# EAGLE design LED ONLY v1 (EAGLE 6.5.0)
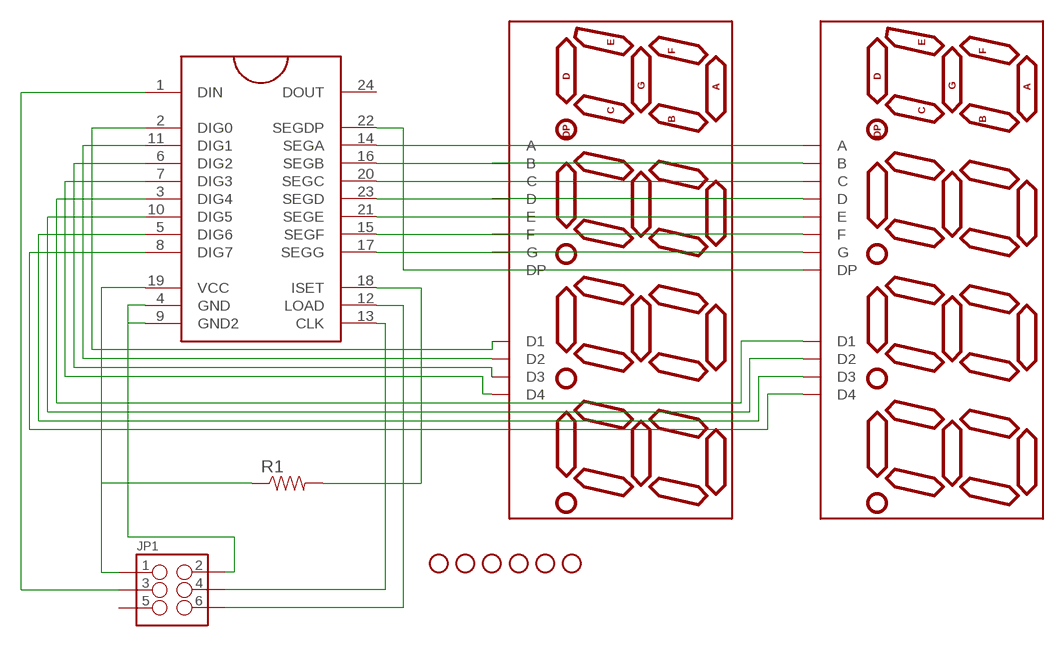
[diagram p0: schematic, sheet 1]

## Parts
JP1  M03X2  [2X3-SHROUDED]
R1  RESISTORPTH-1/4W  [AXIAL-0.4]
STANDOFF1  STAND-OFF  [STAND-OFF]
STANDOFF2  STAND-OFF  [STAND-OFF]
STANDOFF3  STAND-OFF  [STAND-OFF]
STANDOFF4  STAND-OFF  [STAND-OFF]
STANDOFF5  STAND-OFF  [STAND-OFF]
STANDOFF6  STAND-OFF  [STAND-OFF]
U$3  MAX7219DIP  [DIL24]
U$4  7-SEGMENT-4DIGIT-COUNTERPTH  [7-SEGMENT-4DIGIT-COUNTER]
U$5  7-SEGMENT-4DIGIT-COUNTERPTH  [7-SEGMENT-4DIGIT-COUNTER]

## Nets
N$1: U$3.14(SEGA) U$4.11(A) U$5.11(A)
N$2: U$3.16(SEGB) U$4.7(B) U$5.7(B)
N$3: U$3.20(SEGC) U$4.4(C) U$5.4(C)
N$4: U$3.23(SEGD) U$4.2(D) U$5.2(D)
N$5: U$3.21(SEGE) U$4.1(E) U$5.1(E)
N$6: U$3.15(SEGF) U$4.10(F) U$5.10(F)
N$7: U$3.17(SEGG) U$4.5(G) U$5.5(G)
N$8: U$3.22(SEGDP) U$4.3(DP) U$5.3(DP)
N$9: U$3.2(DIG0) U$4.12(D1)
N$10: U$3.11(DIG1) U$4.9(D2)
N$11: U$3.6(DIG2) U$4.8(D3)
N$12: U$3.7(DIG3) U$4.6(D4)
N$13: JP1.1 R1.P$1 U$3.19(VCC)
N$14: JP1.2 U$3.4(GND) U$3.9(GND2)
N$15: U$3.3(DIG4) U$5.12(D1)
N$16: U$3.10(DIG5) U$5.9(D2)
N$17: U$3.5(DIG6) U$5.8(D3)
N$18: U$3.8(DIG7) U$5.6(D4)
N$19: R1.P$2 U$3.18(ISET)
N$21: JP1.3 U$3.1(DIN)
N$22: JP1.6 U$3.12(LOAD)
N$23: JP1.4 U$3.13(CLK)
Unconnected: JP1.5 U$3.24(DOUT)

## Library data of the parts
JP1 = SparkFun-Connectors:M03X2: 2x3 .1" header. Shrouded, with keying- CONN-10681 SMT- CONN-11415 Pogo pins- HW-11044; PROD_ID: CONN-10681
R1 = SparkFun-Resistors:RESISTOR: Resistor Basic schematic elements and footprints for 0603, 1206, and PTH resistors.
STANDOFF1-STANDOFF6 = SparkFun-Electromechanical:STAND-OFF: #4 Stand Off This is the mechanical footprint for a #4 phillips button head screw. Use the keepout ring to avoid running the screw head into surrounding components. SKU : PRT-00447
U$3 = SparkFun-DigitalIC:MAX7219: 8-digit, 8-segment LED display driver, serial input
U$4 U$5 = SparkFun-Displays:7-SEGMENT-4DIGIT-COUNTER

## Board
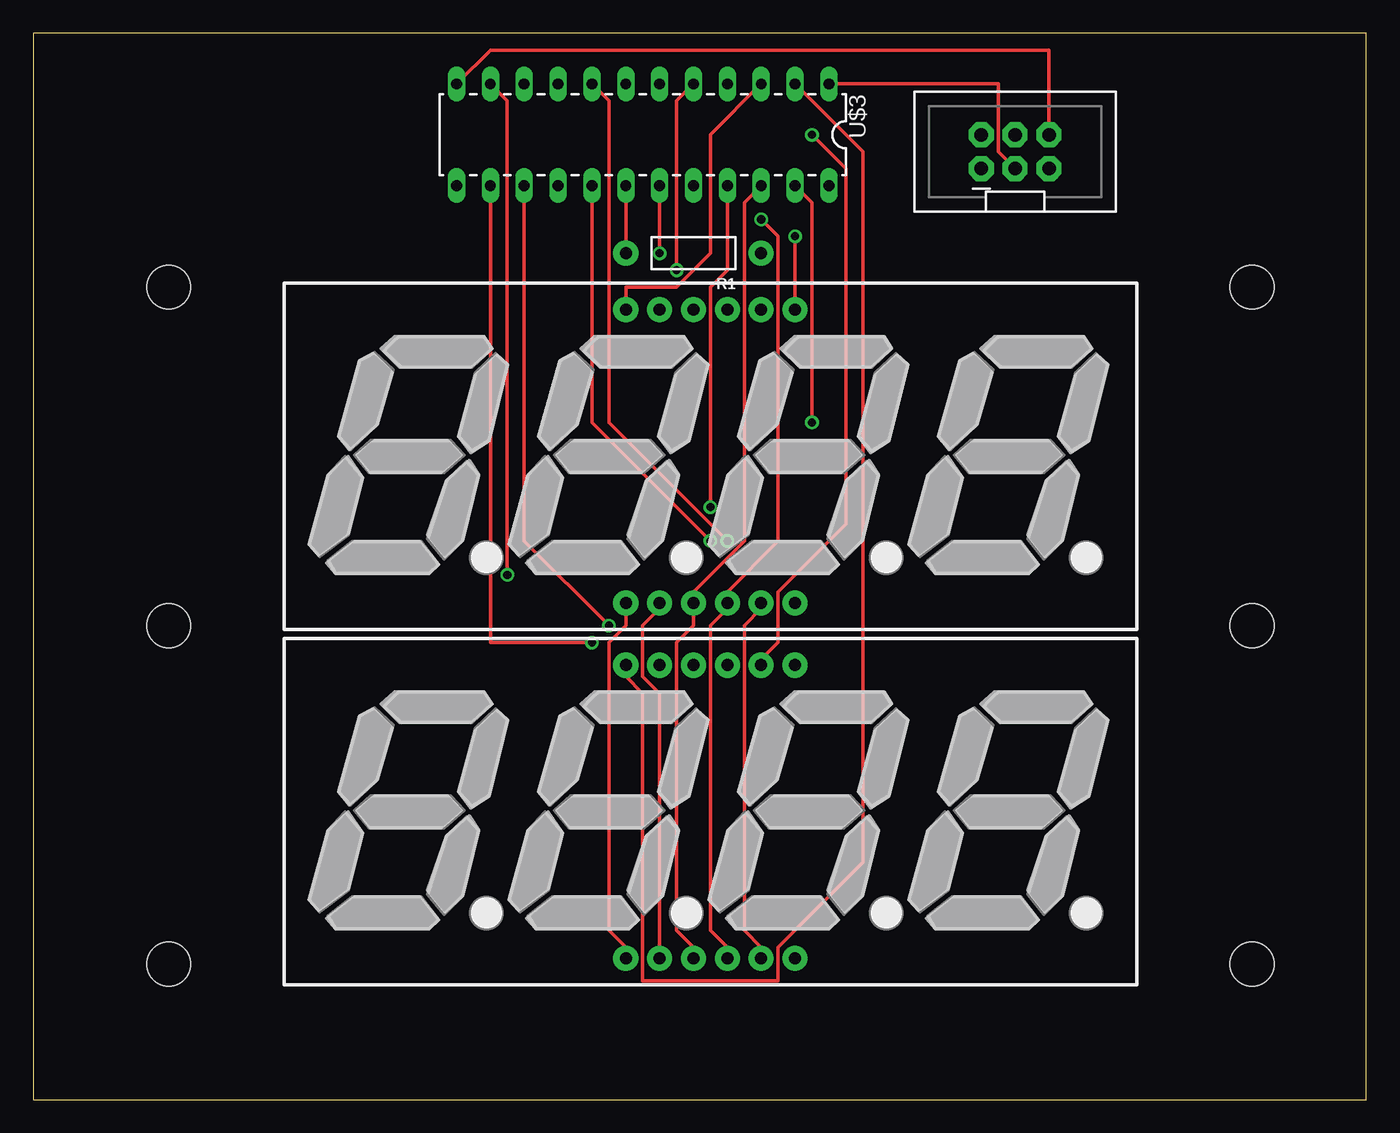
[diagram p1: board, top side]
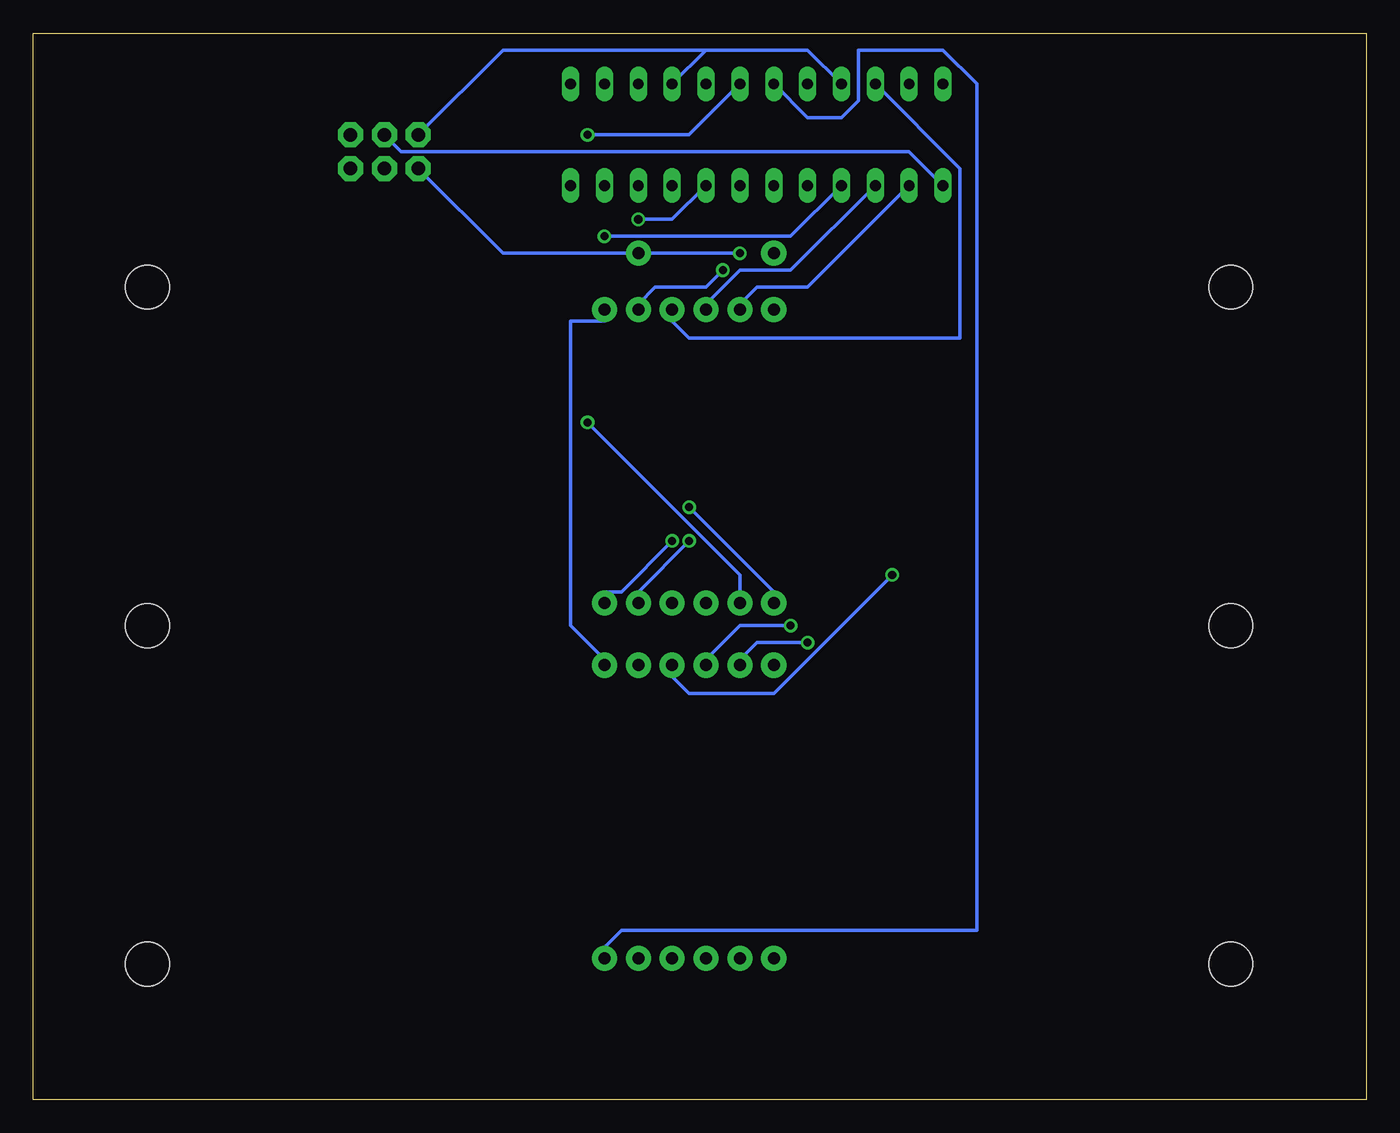
[diagram p2: board, bottom side, seen from below]

Size 100 x 80 mm. Coordinates in mm from the lower left corner, seen from the top.
Outline: 0,0 100,0 100,80 0,80 0,0
Copper layers (1*16): Top 0.035mm / dielectric 1.5mm / Bottom 0.035mm
Design rules "default": minimum track width 10mil, minimum drill 24mil, track to track 8mil, track to pad 8mil, pad to pad 8mil, via to via 8mil, smd to smd 8mil, copper to edge 40mil, drill to drill 8mil, minimum pad ring 10mil, minimum via ring 8mil, stop-mask expansion 4mil, vias tented up to drill 0mil, thermal gap 10mil

### Footprints (pad centres in the part's own frame; a part is rotated, then mirrored left to right if it is on the bottom)
2X3-SHROUDED = drill 1.016 pad 1.88 octagon: 1 -1.27,2.54; 2 1.27,2.54; 3 -1.27,0; 4 1.27,0; 5 -1.27,-2.54; 6 1.27,-2.54
AXIAL-0.4 = drill 0.9 pad 1.88: P$1 -5.08,0; P$2 5.08,0
STAND-OFF = hole 3.302: 0,0
DIL24 = drill 0.813 long: 1 -13.97,-3.81; 2 -11.43,-3.81; 3 -8.89,-3.81; 4 -6.35,-3.81; 5 -3.81,-3.81; 6 -1.27,-3.81; 7 1.27,-3.81; 8 3.81,-3.81; 9 6.35,-3.81; 10 8.89,-3.81; 11 11.43,-3.81; 12 13.97,-3.81; 13 13.97,3.81; 14 11.43,3.81; 15 8.89,3.81; 16 6.35,3.81; 17 3.81,3.81; 18 1.27,3.81; 19 -1.27,3.81; 20 -3.81,3.81; 21 -6.35,3.81; 22 -8.89,3.81; 23 -11.43,3.81; 24 -13.97,3.81
7-SEGMENT-4DIGIT-COUNTER = drill 0.9 pad 1.88: 1 -6.35,-10.998; 2 -3.81,-10.998; 3 -1.27,-10.998; 4 1.27,-10.998; 5 3.81,-10.998; 6 6.35,-10.998; 7 6.35,10.998; 8 3.81,10.998; 9 1.27,10.998; 10 -1.27,10.998; 11 -3.81,10.998; 12 -6.35,10.998

### Placement (x,y rotation side)
JP1  73.66,71.12 90 top
R1  49.53,63.5 180 top
STANDOFF1  10.16,60.96 0 top
STANDOFF2  91.44,60.96 0 top
STANDOFF3  91.44,35.56 0 top
STANDOFF4  10.16,35.56 0 top
STANDOFF5  10.16,10.16 0 top
STANDOFF6  91.44,10.16 0 top
U$3  45.72,72.39 180 top
U$4  50.8,21.59 0 top
U$5  50.8,48.26 0 top

### Tracks (layer width: path | path; a pad name or v marks a point on that pad's centre or on a via)
N$1  (via drill 0.61)
  Top 0.254: v41.91,34.29 34.29,34.29 U$3.14
  Bottom 0.254: U$3.14 41.91,60.96 45.72,60.96 46.99,59.69 U$5.11 | v41.91,34.29 45.72,34.29 46.99,33.02 U$4.11
N$2  (via drill 0.61)
  Top 0.254: U$5.7 v57.15,64.77
  Bottom 0.254: U$3.16 43.18,64.77 v57.15,64.77 | U$4.7 57.15,33.02 59.69,35.56 59.69,58.42 57.15,58.42 U$5.7
N$3  (via drill 0.61)
  Top 0.254: v54.61,66.04 55.88,64.77 55.88,41.91 52.07,38.1 U$5.4 52.07,36.83 50.8,35.56 50.8,12.7 52.07,11.43 U$4.4
  Bottom 0.254: U$3.20 52.07,66.04 v54.61,66.04
N$4  (via drill 0.61)
  Top 0.254: U$3.23 58.42,67.31 v58.42,50.8 | U$4.2 46.99,30.48 45.72,31.75 45.72,35.56 46.99,36.83 U$5.2
  Bottom 0.254: v58.42,50.8 46.99,39.37 U$5.2
N$5  (via drill 0.61)
  Top 0.254: U$3.21 52.07,62.23 50.8,60.96 v50.8,44.45 | U$5.1 44.45,35.56 43.18,34.29 43.18,12.7 44.45,11.43 U$4.1
  Bottom 0.254: v50.8,44.45 44.45,38.1 U$5.1
N$6  (via drill 0.61)
  Top 0.254: v43.18,35.56 36.83,41.91 U$3.15
  Bottom 0.254: U$3.15 43.18,62.23 46.99,62.23 49.53,59.69 U$5.10 | v43.18,35.56 46.99,35.56 49.53,33.02 U$4.10
N$7  (via drill 0.61)
  Top 0.254: U$3.17 41.91,50.8 v50.8,41.91 | U$4.5 54.61,11.43 53.34,12.7 53.34,35.56 54.61,36.83 U$5.5
  Bottom 0.254: v50.8,41.91 54.61,38.1 U$5.5
N$8
  Top 0.254: U$3.22 53.34,67.31 53.34,41.91 49.53,38.1 U$5.3 49.53,35.56 48.26,34.29 48.26,12.7 49.53,11.43 U$4.3
N$9
  Top 0.254: U$3.2 62.23,71.12 62.23,17.78 55.88,11.43 55.88,8.89 45.72,8.89 45.72,30.48 44.45,31.75 U$4.12
N$10  (via drill 0.61)
  Top 0.254: U$3.11 35.56,74.93 v35.56,39.37
  Bottom 0.254: v35.56,39.37 44.45,30.48 50.8,30.48 52.07,31.75 U$4.9
N$11  (via drill 0.61)
  Top 0.254: v58.42,72.39 60.96,69.85 60.96,43.18 55.88,38.1 55.88,34.29 54.61,33.02 U$4.8
  Bottom 0.254: U$3.6 50.8,72.39 v58.42,72.39
N$12
  Bottom 0.254: U$3.7 41.91,73.66 39.37,73.66 38.1,74.93 38.1,78.74 31.75,78.74 29.21,76.2 29.21,12.7 55.88,12.7 57.15,11.43 U$4.6
N$13  (via drill 0.61)
  Top 0.254: v46.99,63.5 U$3.19
  Bottom 0.254: v46.99,63.5 R1.P$1 64.77,63.5 JP1.1
N$14
  Bottom 0.254: U$3.9 41.91,78.74 49.53,78.74 | U$3.4 49.53,78.74 | JP1.2 64.77,78.74 49.53,78.74
N$15
  Top 0.254: U$3.3 50.8,72.39 50.8,63.5 48.26,60.96 44.45,60.96 U$5.12
N$16
  Bottom 0.254: U$3.10 30.48,69.85 30.48,57.15 50.8,57.15 52.07,58.42 U$5.9
N$17  (via drill 0.61)
  Top 0.254: U$3.5 48.26,74.93 v48.26,62.23
  Bottom 0.254: v48.26,62.23 49.53,60.96 53.34,60.96 54.61,59.69 U$5.8
N$18  (via drill 0.61)
  Top 0.254: U$3.8 43.18,74.93 43.18,50.8 v52.07,41.91
  Bottom 0.254: v52.07,41.91 55.88,38.1 57.15,38.1 U$5.6
N$19
  Top 0.254: R1.P$2 U$3.18
N$21
  Top 0.254: U$3.1 72.39,76.2 72.39,71.12 JP1.3
N$22
  Top 0.254: U$3.12 34.29,78.74 76.2,78.74 JP1.6
N$23
  Bottom 0.254: U$3.13 34.29,71.12 72.39,71.12 JP1.4